# Altium schematic sheet Sheet1.SCHDOC
size 420 x 297 mm; SheetNumber: 1; SheetTotal: 1; DocumentName: Sheet1.SCHDOC
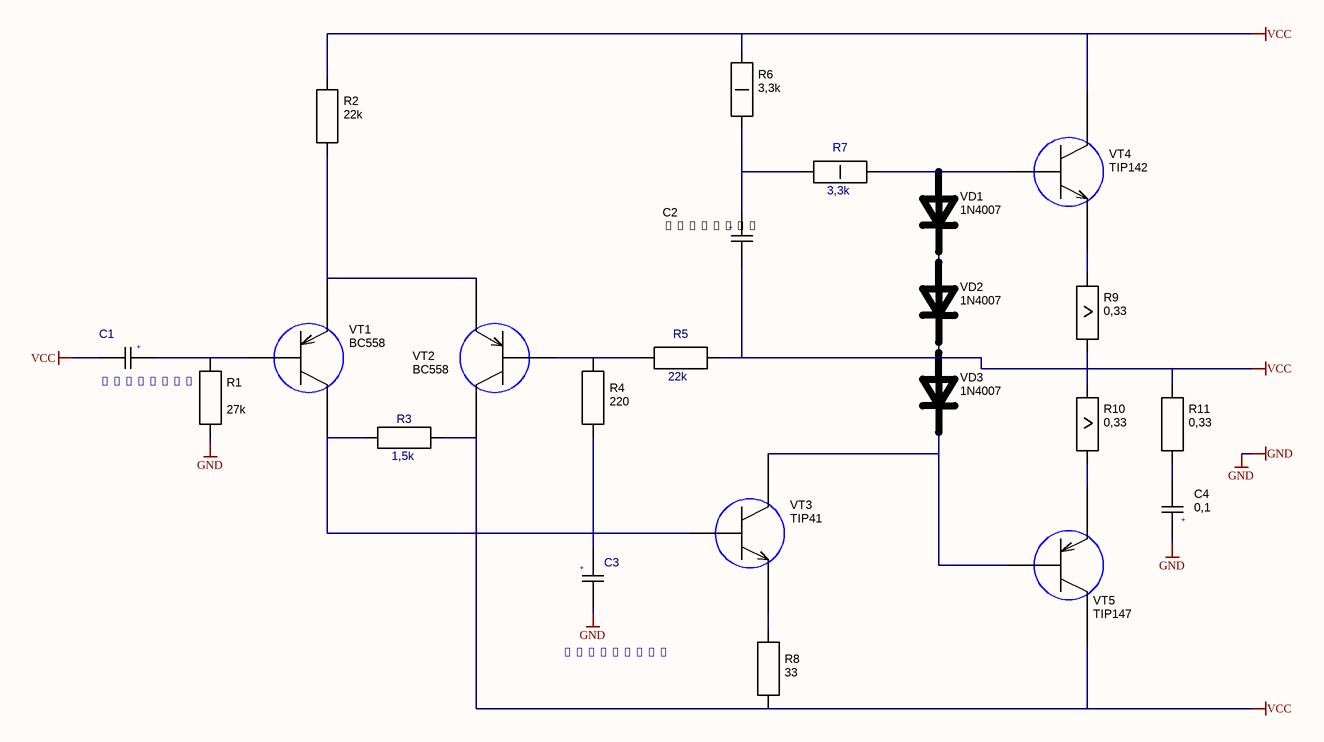
[diagram p0: Sheet1.SCHDOC]

## Parts
1  BC558B  [TO-92-4]  (value not drawn)
4  BC558B  [TO-92-4]  (value not drawn)
C1  K50_29  [K50_29]  (value not drawn)
C2  K50_29  [K50_29]  (value not drawn)
C3  K50_29  [K50_29]  (value not drawn)
C4  K50_29  [K50_29]  (value not drawn)
R1  C2-33H-1W_OLD_UGO  [C2-33H-1W_17.5MM]  (value not drawn)
R2  C2-33�-0.125W_10��  [C2-33H-0.125W_10MM]  (value not drawn)
R3  C2-33�-0.125W_10��  [C2-33H-0.125W_10MM]  (value not drawn)
R4  C2-33�-0.125W_10��  [C2-33H-0.125W_10MM]  (value not drawn)
R5  C2-33�-0.125W_10��  [C2-33H-0.125W_10MM]  (value not drawn)
R6  C2-33�-0.125W_10��  [C2-33H-0.125W_10MM]  (value not drawn)
R7  C2-33H-1W_OLD_UGO  [C2-33H-1W_17.5MM]  (value not drawn)
R8  C2-33H-0.5W_OLD_UGO  [C2-33H-0.5W_15MM]  (value not drawn)
R10  C2-33�-0.125W_10��  [C2-33H-0.125W_10MM]  (value not drawn)
R11  C2-33�-0.125W_10��  [C2-33H-0.125W_10MM]  (value not drawn)
R12  C2-33H-0.5W_OLD_UGO  [C2-33H-0.5W_15MM]  (value not drawn)
U1  TRANSISTOR_(1111)  [2T602A]  (value not drawn)
VD1  1N4007  [DO-41(DO-204AL)]  (value not drawn)
VD2  1N4007  [DO-41(DO-204AL)]  (value not drawn)
VD3  1N4007  [DO-41(DO-204AL)]  (value not drawn)
VT1  ��101  [��101]  (value not drawn)
VT2  ��101  [��101]  (value not drawn)

## Nets
GND: C2.1 C4.2 R2.1
VCC: 1.C 4.C C1.1 C2.2 C3.1 R1.2 R3.1 R3.2 R4.2 R5.2 R6.2 R8.2 R10.1 R11.2 R12.1 U1.1 VT1.3(K) VT2.2(B)
Net1_B: 1.B C1.2 R2.2
Net1_E: 1.E R6.1 U1.3
Net4_B: 4.B VD3.K VT2.3(K)
Net4_E: 4.E R12.2
NetC3_2: C3.2 R1.1 R7.1
NetC4_1: C4.1 R10.2
NetR4_1: R4.1 R5.1 U1.2
NetR7_2: R7.2 VD1.A VT1.2(B)
NetR8_1: R8.1 VT1.1(E)
NetR11_1: R11.1 VT2.1(E)
NetVD1_K: VD1.K VD2.A
NetVD2_K: VD2.K VD3.A

## Notes on the sheet
- (near R6) R2
  22k
- (near R1) R6
  3,3k
- (near R7) 3,3k
- (near R7) R7
- (near VT1) VT4
  TIP142
- (near C3) C2
  10�Fx63V
- (near VD1) VD1
  1N4007
- (near VD2) VD2
  1N4007
- (near R8) R9
  0,33
- (near C1) C1
- (near C1) 10�Fx25V
- (near 1) VT1
  BC558
- (near U1) VT2
  BC558
- (near R5) 22k
- (near R5) R5
- (near VD3) VD3
  1N4007
- (near R2) R1
  27k
- (near R3) 1,5k
- (near R3) R3
- R4
  220
- (near R12) R10
  0,33
- (near R10) R11
  0,33
- (near VT2) VT3
  TIP41
- (near C4) C4
  0,1
- (near C2) C3
- 100�Fx50V
- (near 4) VT5
  TIP147
- (near R11) R8
  33
- (in symbol K50_29) +

## Library data of the parts
C1 = K50_29: Value: 10�Fx25V
R1 R7 = C2-33H-1W_OLD_UGO: Autor: pcbdesigner.ru; Value: *
R2 = C2-33�-0.125W_10��: Value: 27K
R8 R12 = C2-33H-0.5W_OLD_UGO: Autor: pcbdesigner.ru; Value: *
1 4 = BC558B: Value: *
C2-C4 = K50_29: Value: *
R3-R6 R10 R11 = C2-33�-0.125W_10��: Value: *
U1 = TRANSISTOR_(1111): Value: *
VD1-VD3 = 1N4007: Value: *
VT1 VT2 = ��101: Value: *